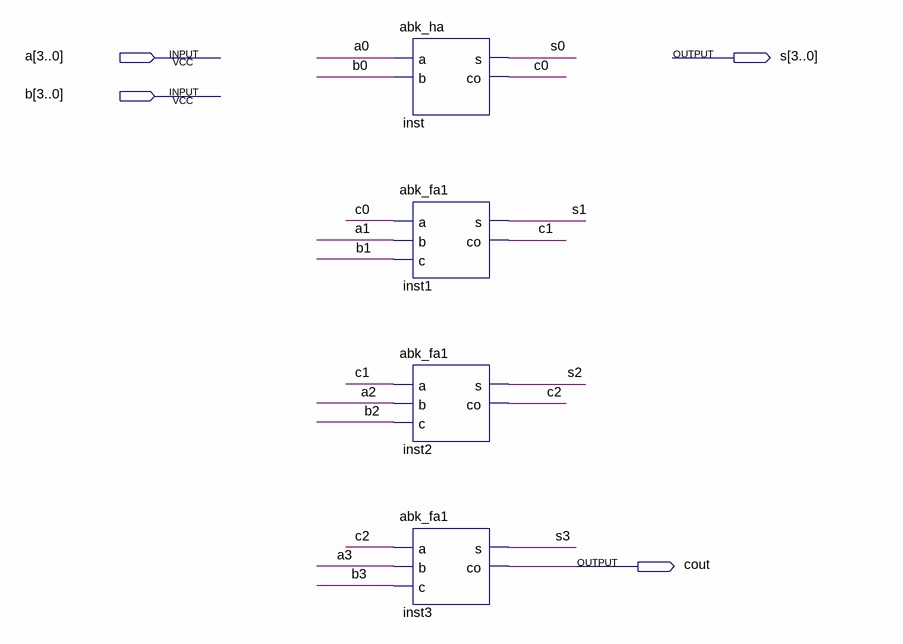
[diagram p0: schematic sheet]
// Quartus schematic abk_rca4.bdf as structural Verilog: 4 symbols, 4 pins
module abk_rca4 (
  input  [3:0] a,
  input  [3:0] b,
  output [3:0] s,
  output cout
);

  wire c0, c1, c2;

  abk_ha inst (.a(a[0]), .b(b[0]), .s(s[0]), .co(c0));
  abk_fa1 inst1 (.a(c0), .b(a[1]), .c(b[1]), .s(s[1]), .co(c1));
  abk_fa1 inst2 (.a(c1), .b(a[2]), .c(b[2]), .s(s[2]), .co(c2));
  abk_fa1 inst3 (.a(c2), .b(a[3]), .c(b[3]), .s(s[3]), .co(cout));
endmodule
